# EAGLE board base-module-r1_MI_1 (EAGLE 5.12)
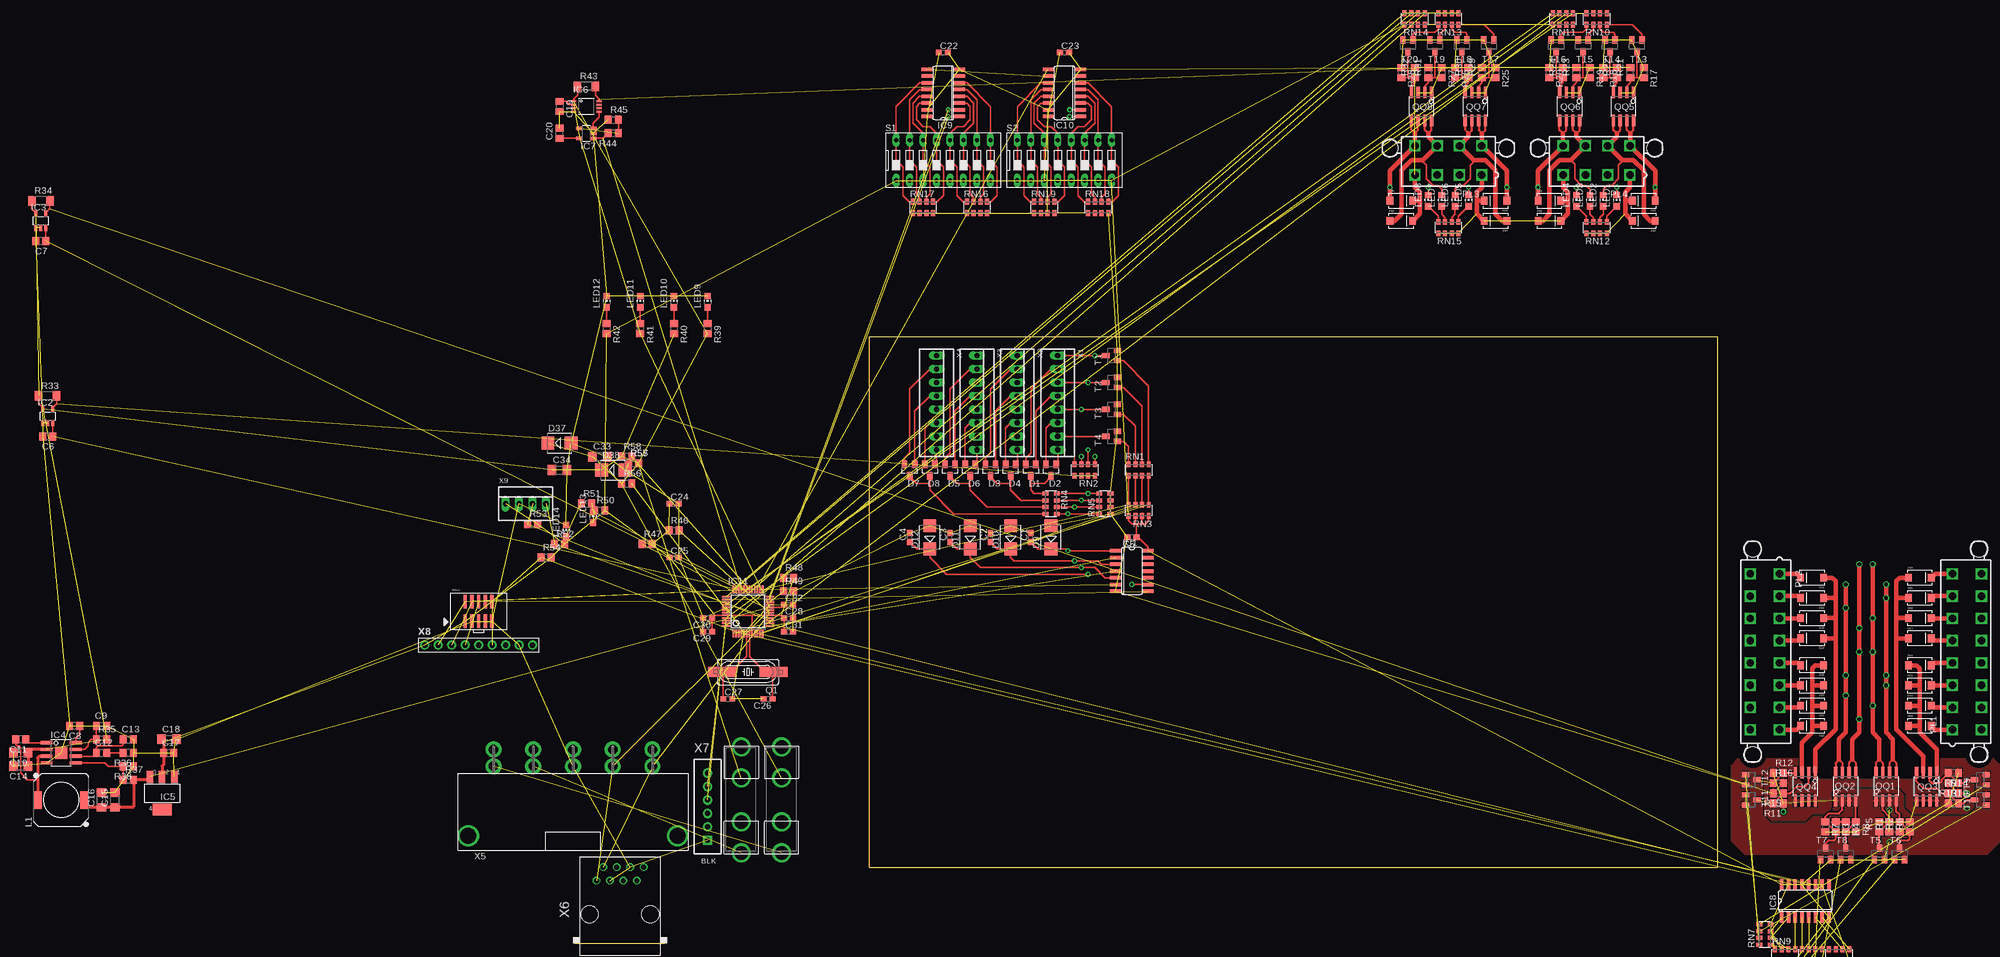
[diagram p3: board, top side]
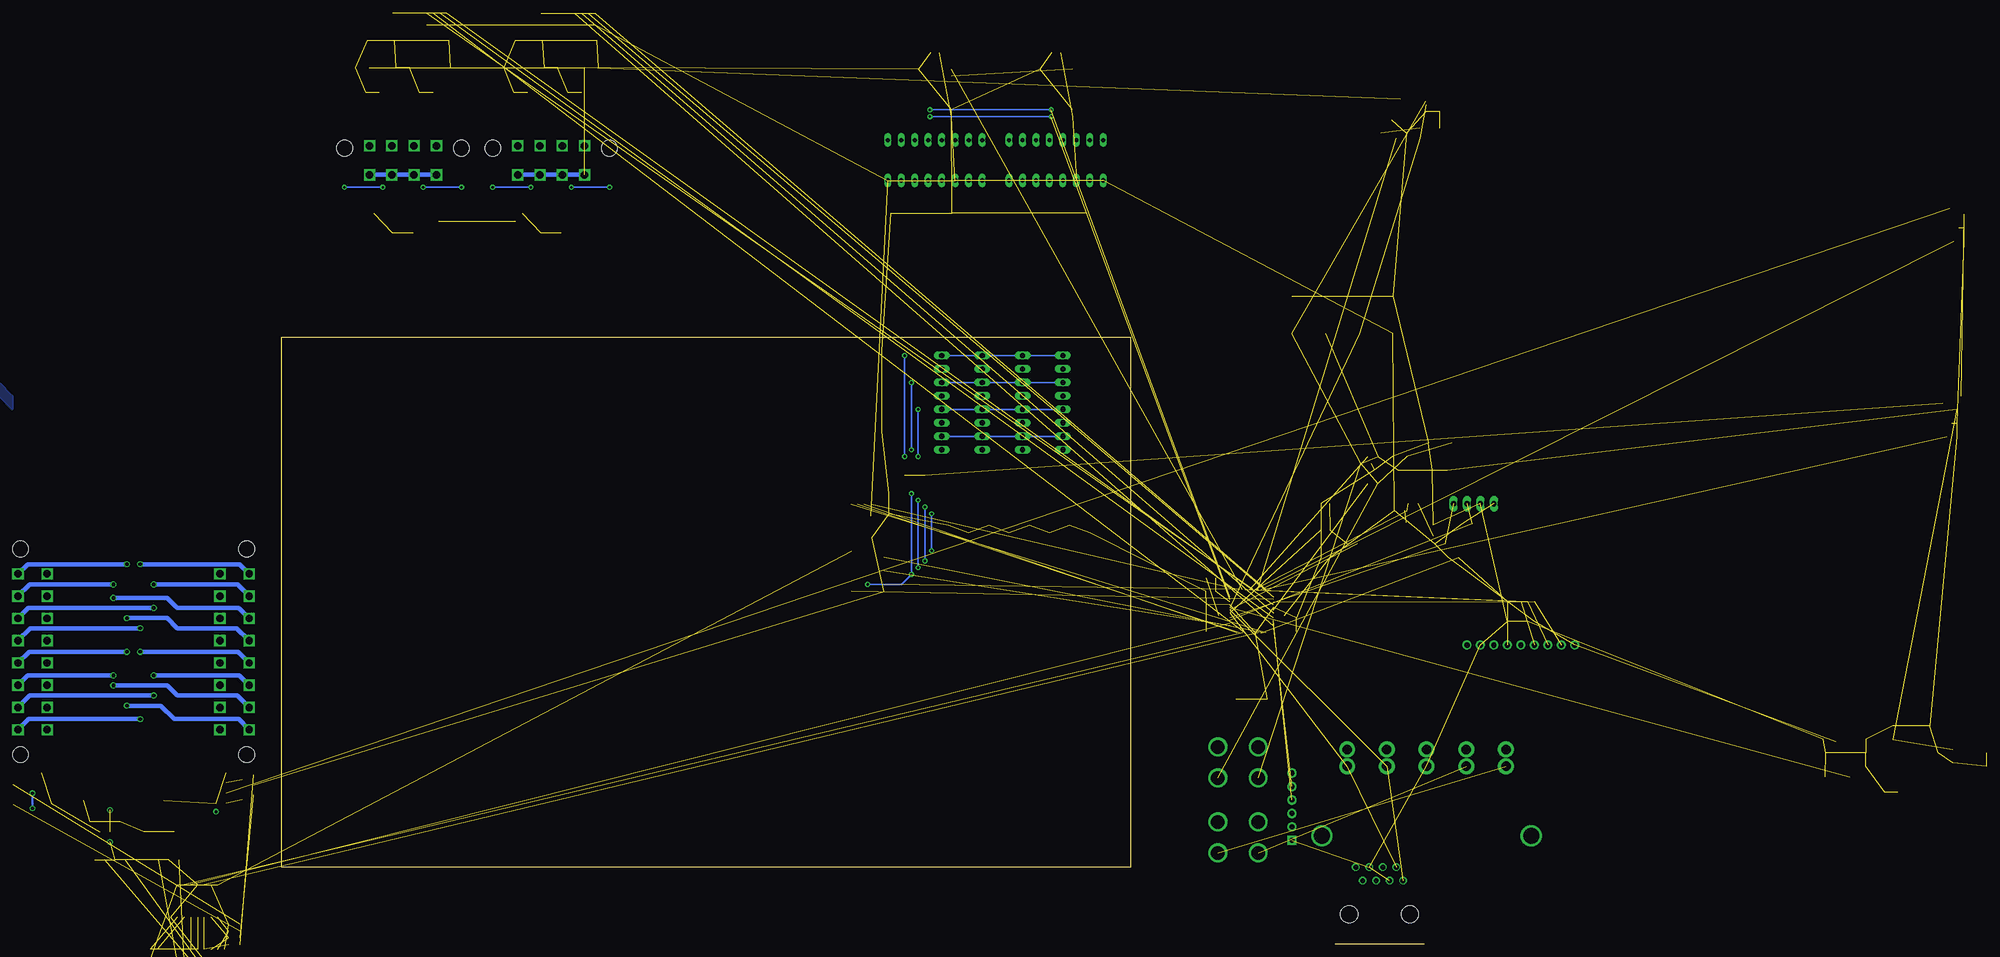
[diagram p4: board, bottom side, seen from below]

Size 215.44 x 114.4 mm. Coordinates in mm from the lower left corner, seen from the top.
Outline: 55.44,14.4 215.44,14.4 215.44,114.4 55.44,114.4 55.44,14.4
Copper layers (1*16): Top 0.035mm / dielectric 1.5mm / Bottom 0.035mm
Design rules "default *": minimum track width 10mil, minimum drill 0.6mm, track to track 8mil, track to pad 8mil, pad to pad 7mil, via to via 8mil, smd to smd 8mil, copper to edge 40mil, drill to drill 8mil, minimum pad ring 10mil, minimum via ring 8mil, stop-mask expansion 4mil, vias tented up to drill 0mil, thermal gap 10mil

## Footprints (pad centres in the part's own frame; a part is rotated, then mirrored left to right if it is on the bottom)
C0603 = smd 1.1 x 1: 1 -0.85,0; 2 0.85,0
C0805 = smd 1.3 x 1.5: 1 -0.95,0; 2 0.95,0
C1206 = smd 1.6 x 1.8: 1 -1.4,0; 2 1.4,0
SOT23 = smd 1 x 1.4: 1 -0.95,-1.1; 2 0.95,-1.1; 3 0,1.1
SMB = smd 2.4 x 2.4: A 2.2,0; C -2.2,0
SMA-DIODE = smd 1.27 x 1.47: A -2.15,0; C 2.15,0
FUSE_5MM = drill 2.54 pad 3.556 round: 1 0,-10; 2 0,-4.158; 3 0,4.158; 4 0,10
SO14 = smd 0.66 x 2.032: 1 -3.81,-3.073; 2 -2.54,-3.073; 3 -1.27,-3.073; 4 0,-3.073; 5 1.27,-3.073; 6 2.54,-3.073; 7 3.81,-3.073; 8 3.81,3.073; 9 2.54,3.073; 10 1.27,3.073; 11 0,3.073; 12 -1.27,3.073; 13 -2.54,3.073; 14 -3.81,3.073
SOT23-5L = smd 0.55 x 1.2: 1 -0.95,-1.3; 2 0,-1.3; 3 0.95,-1.3; 4 0.95,1.3; 5 -0.95,1.3
SO08 = smd 0.61 x 2.21: 1 -1.905,-2.75; 2 -0.635,-2.75; 3 0.635,-2.75; 4 1.905,-2.75; 5 1.905,2.75; 6 0.635,2.75; 7 -0.635,2.75; 8 -1.905,2.75 | smd 2.3 x 2.3: SLUG 0,0
SOT223 = smd 1.219 x 2.235: 1 -2.311,-3.099; 2 0,-3.099; 3 2.311,-3.099 | smd 3.6 x 2.2: 4 0,3.099
MSOP-8 = smd 0.41 x 1.02: 1 -0.975,-2.4; 2 -0.325,-2.4; 3 0.325,-2.4; 4 0.975,-2.4; 5 0.975,2.4; 6 0.325,2.4; 7 -0.325,2.4; 8 -0.975,2.4
SOT23-5 = smd 0.6 x 1.2: 1 -0.95,-1.306; 2 0,-1.306; 3 0.95,-1.306; 4 0.95,1.306; 5 -0.95,1.306
SO16 = smd 0.66 x 2.032: 1 -4.445,-3.073; 2 -3.175,-3.073; 3 -1.905,-3.073; 4 -0.635,-3.073; 5 0.635,-3.073; 6 1.905,-3.073; 7 3.175,-3.073; 8 4.445,-3.073; 9 4.445,3.073; 10 3.175,3.073; 11 1.905,3.073; 12 0.635,3.073; 13 -0.635,3.073; 14 -1.905,3.073; 15 -3.175,3.073; 16 -4.445,3.073
LQFP48 = smd 0.3 x 1.6: 1 -2.75,-4.1; 2 -2.25,-4.1; 3 -1.75,-4.1; 4 -1.25,-4.1; 5 -0.75,-4.1; 6 -0.25,-4.1; 7 0.25,-4.1; 8 0.75,-4.1; 9 1.25,-4.1; 10 1.75,-4.1; 11 2.25,-4.1; 12 2.75,-4.1; 25 2.75,4.1; 26 2.25,4.1; 27 1.75,4.1; 28 1.25,4.1; 29 0.75,4.1; 30 0.25,4.1; 31 -0.25,4.1; 32 -0.75,4.1; 33 -1.25,4.1; 34 -1.75,4.1; 35 -2.25,4.1; 36 -2.75,4.1 | smd 1.6 x 0.3: 13 4.1,-2.75; 14 4.1,-2.25; 15 4.1,-1.75; 16 4.1,-1.25; 17 4.1,-0.75; 18 4.1,-0.25; 19 4.1,0.25; 20 4.1,0.75; 21 4.1,1.25; 22 4.1,1.75; 23 4.1,2.25; 24 4.1,2.75; 37 -4.1,2.75; 38 -4.1,2.25; 39 -4.1,1.75; 40 -4.1,1.25; 41 -4.1,0.75; 42 -4.1,0.25; 43 -4.1,-0.25; 44 -4.1,-0.75; 45 -4.1,-1.25; 46 -4.1,-1.75; 47 -4.1,-2.25; 48 -4.1,-2.75
2X05_1.27MM_SMT = smd 0.65 x 2.6: 1 -2.54,-1.85; 2 -2.54,1.85; 3 -1.27,-1.85; 4 -1.27,1.85; 5 0,-1.85; 6 0,1.85; 7 1.27,-1.85; 8 1.27,1.85; 9 2.54,-1.85; 10 2.54,1.85
DR1030 = smd 3.3 x 1.6: 1 0,4.45; 2 0,-4.45
CHIP-LED0805 = smd 1.2 x 1.2: A 0,-1.05; C 0,1.05
5566-16 = drill 1.4 square: 1 14.7,-2.75; 2 10.5,-2.75; 3 6.3,-2.75; 4 2.1,-2.75; 5 -2.1,-2.75; 6 -6.3,-2.75; 7 -10.5,-2.75; 8 -14.7,-2.75; 9 14.7,2.75; 10 10.5,2.75; 11 6.3,2.75; 12 2.1,2.75; 13 -2.1,2.75; 14 -6.3,2.75; 15 -10.5,2.75; 16 -14.7,2.75 | hole 3: 19.4,2.29; -19.4,2.29
5566-8 = drill 1.4 square: 1 6.3,-2.75; 2 2.1,-2.75; 3 -2.1,-2.75; 4 -6.3,-2.75; 5 6.3,2.75; 6 2.1,2.75; 7 -2.1,2.75; 8 -6.3,2.75 | hole 3: 11,2.29; -11,2.29
HC49UP = smd 5.334 x 1.93: 1 -4.826,0; 2 4.826,0
SO-8 = smd 2.21 x 0.61: 1 -2.616,1.905; 2 -2.616,0.635; 3 -2.616,-0.635; 4 -2.616,-1.905; 5 2.616,-1.905; 6 2.616,-0.635; 7 2.616,0.635; 8 2.616,1.905
R0805 = smd 1.3 x 1.5: 1 -0.95,0; 2 0.95,0
M3516 = smd 1.4 x 1.8: 1 -1.7,0; 2 1.7,0
EXBS8V = smd 0.75 x 1.1: 1 -1.905,-1.07; 2 -0.635,-1.07; 3 0.635,-1.07; 4 1.905,-1.07; 5 1.905,1.07; 6 0.635,1.07; 7 -0.635,1.07; 8 -1.905,1.07
DS-08 = drill 0.813 long: 1 -8.89,-3.81; 2 -6.35,-3.81; 3 -3.81,-3.81; 4 -1.27,-3.81; 5 1.27,-3.81; 6 3.81,-3.81; 7 6.35,-3.81; 8 8.89,-3.81; 9 8.89,3.81; 10 6.35,3.81; 11 3.81,3.81; 12 1.27,3.81; 13 -1.27,3.81; 14 -3.81,3.81; 15 -6.35,3.81; 16 -8.89,3.81
SOT23-BEC = smd 1 x 1.4: B -0.95,-1.1; C 0,1.1; E 0.95,-1.1
22-23-2081 = drill 1 long: 1 -8.89,0; 2 -6.35,0; 3 -3.81,0; 4 -1.27,0; 5 1.27,0; 6 3.81,0; 7 6.35,0; 8 8.89,0
43160-XX05 = drill 1.8 pad 3 round: 1@1 -14.98,0; 1@2 -14.98,3.18; 2@1 -7.49,0; 2@2 -7.49,3.18; 3@1 0,0; 3@2 0,3.18; 4@1 7.49,0; 4@2 7.49,3.18; 5@1 14.98,0; 5@2 14.98,3.18 | drill 3 pad 3.4 round: M1 -19.73,-13.13; M2 19.73,-13.13
RJ45-NO-SHIELD = drill 0.9 pad 1.4 round: 1 -4.445,6.35; 2 -3.175,8.89; 3 -1.905,6.35; 4 -0.635,8.89; 5 0.635,6.35; 6 1.905,8.89; 7 3.175,6.35; 8 4.445,8.89 | hole 3.251: -5.715,0; 5.715,0
USBCABLE-0.100-NOLBL = drill 1 pad 1.778 square: 1 0,-7.62 | drill 1 pad 1.778 round: 2 0,-5.08; 3 0,-2.54; 4 0,0; 5 0,2.54; 6 0,5.08
100MIL-9 = drill 1 pad 1.676 round: 1 -10.16,0; 2 -7.62,0; 3 -5.08,0; 4 -2.54,0; 5 0,0; 6 2.54,0; 7 5.08,0; 8 7.62,0; 9 10.16,0
22-23-2041 = drill 1 long: 1 -3.81,0; 2 -1.27,0; 3 1.27,0; 4 3.81,0

## Placement (x,y rotation side)
C1  CYA  [C0603]  85.92,76.63 90 top
C2  CYA  [C0603]  78.3,76.63 90 top
C3  CYA  [C0603]  70.68,76.63 90 top
C4  CYA  [C0603]  63.06,76.63 90 top
C5  100n  [C0603]  104.97,76.63 180 top
C6  .047  [C0805]  -99.5,95.68 180 top  (outside the outline)
C7  .047  [C0805]  -100.77,132.51 180 top  (outside the outline)
C8  100n  [C0805]  -94.42,41.07 180 top  (outside the outline)
C9  100n  [C0805]  -89.34,41.07 0 top  (outside the outline)
C10  10u  [C1206]  -104.58,35.99 180 top  (outside the outline)
C11  100n  [C0805]  -104.58,38.53 180 top  (outside the outline)
C12  3.3n  [C0805]  -89.34,35.99 0 top  (outside the outline)
C13  DNP  [C0805]  -84.26,38.53 0 top  (outside the outline)
C14  10u  [C1206]  -104.58,33.45 180 top  (outside the outline)
C15  22u  [C1206]  -86.8,27.1 90 top  (outside the outline)
C16  22u  [C1206]  -89.34,27.1 90 top  (outside the outline)
C17  2.2u  [C0805]  -76.64,35.99 0 top  (outside the outline)
C18  10u  [C1206]  -76.64,38.53 0 top  (outside the outline)
C19  100n  [C0805]  -2.98,157.91 270 top  (outside the outline)
C20  100n  [C0805]  -2.98,152.83 90 top  (outside the outline)
C21  100n  [C0603]  226.89,-12.27 0 top  (outside the outline)
C22  100n  [C0603]  69.41,168.07 0 top  (outside the outline)
C23  100n  [C0603]  92.27,168.07 0 top  (outside the outline)
C24  1n  [C0603]  18.61,82.98 0 top
C25  10n  [C0603]  18.61,72.82 0 top
C26  18p  [C0603]  36.39,46.15 180 top
C27  18p  [C0603]  28.77,46.15 0 top
C28  10n  [C0603]  40.2,61.39 0 top
C29  10n  [C0603]  24.96,58.85 180 top
C30  100n  [C0603]  24.96,61.39 180 top
C31  100n  [C0603]  40.2,58.85 0 top
C32  100n  [C0603]  40.2,63.93 0 top
C33  10u  [C1206]  4.64,91.87 0 top
C34  10u  [C1206]  -2.98,89.33 0 top
D1  BAT54C  [SOT23]  85.92,89.33 180 top
D2  BAT54C  [SOT23]  89.73,89.33 180 top
D3  BAT54C  [SOT23]  78.3,89.33 180 top
D4  BAT54C  [SOT23]  82.11,89.33 180 top
D5  BAT54C  [SOT23]  70.68,89.33 180 top
D6  BAT54C  [SOT23]  74.49,89.33 180 top
D7  BAT54C  [SOT23]  63.06,89.33 180 top
D8  BAT54C  [SOT23]  66.87,89.33 180 top
D9  [SMB]  89.73,76.63 90 top
D10  [SMB]  82.11,76.63 90 top
D11  [SMB]  74.49,76.63 90 top
D12  [SMB]  66.87,76.63 90 top
D13  [SMA-DIODE]  253.56,41.07 0 top  (outside the outline)
D14  [SMA-DIODE]  253.56,44.88 0 top  (outside the outline)
D15  [SMA-DIODE]  253.56,48.69 0 top  (outside the outline)
D16  [SMA-DIODE]  253.56,52.5 0 top  (outside the outline)
D17  [SMA-DIODE]  253.56,57.58 0 top  (outside the outline)
D18  [SMA-DIODE]  253.56,61.39 0 top  (outside the outline)
D19  [SMA-DIODE]  253.56,65.2 0 top  (outside the outline)
D20  [SMA-DIODE]  253.56,69.01 0 top  (outside the outline)
D21  [SMA-DIODE]  233.24,69.01 180 top  (outside the outline)
D22  [SMA-DIODE]  233.24,65.2 180 top  (outside the outline)
D23  [SMA-DIODE]  233.24,61.39 180 top  (outside the outline)
D24  [SMA-DIODE]  233.24,57.58 180 top  (outside the outline)
D25  [SMA-DIODE]  233.24,52.5 180 top  (outside the outline)
D26  [SMA-DIODE]  233.24,48.69 180 top  (outside the outline)
D27  [SMA-DIODE]  233.24,44.88 180 top  (outside the outline)
D28  [SMA-DIODE]  233.24,41.07 180 top  (outside the outline)
D29  [SMA-DIODE]  201.49,140.13 180 top  (outside the outline)
D30  [SMA-DIODE]  201.49,136.32 180 top  (outside the outline)
D31  [SMA-DIODE]  183.71,136.32 0 top  (outside the outline)
D32  [SMA-DIODE]  183.71,140.13 0 top  (outside the outline)
D33  [SMA-DIODE]  173.55,140.13 180 top  (outside the outline)
D34  [SMA-DIODE]  173.55,136.32 180 top  (outside the outline)
D35  [SMA-DIODE]  155.77,136.32 0 top  (outside the outline)
D36  [SMA-DIODE]  155.77,140.13 0 top  (outside the outline)
D37  [SMB]  -2.98,94.41 0 top
D38  [SMB]  7.18,89.33 0 top
F1  FUSEX20MM  [FUSE_5MM]  38.93,27.1 0 top
F2  FUSEX20MM  [FUSE_5MM]  31.31,27.1 0 top
IC1  74HC14D  [SO14]  104.97,70.28 270 top
IC2  TS1102  [SOT23-5L]  -99.5,99.49 0 top  (outside the outline)
IC3  TS1102  [SOT23-5L]  -100.77,136.32 0 top  (outside the outline)
IC4  RT7247A  [SO08]  -96.96,35.99 270 top  (outside the outline)
IC5  LM1117-3.3V  [SOT223]  -77.91,28.37 180 top  (outside the outline)
IC6  LMP8480MM  [MSOP-8]  2.1,157.91 270 top  (outside the outline)
IC7  MCP6001  [SOT23-5]  2.1,152.83 90 top  (outside the outline)
IC8  74HC595D  [SO16]  231.97,8.05 0 top  (outside the outline)
IC9  74HC165D  [SO16]  69.41,160.45 90 top  (outside the outline)
IC10  74HC165D  [SO16]  92.27,160.45 90 top  (outside the outline)
IC11  LPC11C22/24-LQFP48  [LQFP48]  32.58,62.66 0 top
JTAG1  [2X05_1.27MM_SMT]  -18.22,62.66 0 top  (outside the outline)
L1  [DR1030]  -96.96,27.1 90 top  (outside the outline)
LED1  [CHIP-LED0805]  196.41,140.13 0 top  (outside the outline)
LED2  [CHIP-LED0805]  193.87,140.13 0 top  (outside the outline)
LED3  [CHIP-LED0805]  191.33,140.13 0 top  (outside the outline)
LED4  [CHIP-LED0805]  188.79,140.13 0 top  (outside the outline)
LED5  [CHIP-LED0805]  168.47,140.13 0 top  (outside the outline)
LED6  [CHIP-LED0805]  165.93,140.13 0 top  (outside the outline)
LED7  [CHIP-LED0805]  163.39,140.13 0 top  (outside the outline)
LED8  [CHIP-LED0805]  160.85,140.13 0 top  (outside the outline)
LED9  PWR  [CHIP-LED0805]  24.96,121.08 0 top  (outside the outline)
LED10  12V  [CHIP-LED0805]  18.61,121.08 0 top  (outside the outline)
LED11  5V  [CHIP-LED0805]  12.26,121.08 0 top  (outside the outline)
LED12  3.3V  [CHIP-LED0805]  5.91,121.08 0 top  (outside the outline)
LED13  HBB  [CHIP-LED0805]  3.37,80.44 0 top
LED14  HBA  [CHIP-LED0805]  -1.71,77.9 0 top
PL1  [5566-16]  262.45,55.04 270 top  (outside the outline)
PL2  [5566-16]  224.35,55.04 90 top  (outside the outline)
PL3  [5566-8]  164.66,147.75 0 top  (outside the outline)
PL4  [5566-8]  192.6,147.75 0 top  (outside the outline)
Q1  12MHz  [HC49UP]  32.58,51.23 180 top
QQ1  IRF9910  [SO-8]  247.21,29.64 90 top  (outside the outline)
QQ2  IRF9910  [SO-8]  239.59,29.64 90 top  (outside the outline)
QQ3  IRF9362  [SO-8]  254.83,29.64 270 top  (outside the outline)
QQ4  IRF9362  [SO-8]  231.97,29.64 270 top  (outside the outline)
QQ5  DMN6040SSD  [SO-8]  197.68,157.91 270 top  (outside the outline)
QQ6  DMN6040SSD  [SO-8]  187.52,157.91 270 top  (outside the outline)
QQ7  DMN6040SSD  [SO-8]  169.74,157.91 270 top  (outside the outline)
QQ8  DMN6040SSD  [SO-8]  159.58,157.91 270 top  (outside the outline)
R1  [R0805]  247.84,22.02 90 top  (outside the outline)
R2  [R0805]  249.75,22.02 90 top  (outside the outline)
R3  [R0805]  237.68,22.02 270 top  (outside the outline)
R4  [R0805]  239.59,22.02 270 top  (outside the outline)
R5  [R0805]  245.94,22.02 90 top  (outside the outline)
R6  [R0805]  251.65,22.02 90 top  (outside the outline)
R7  [R0805]  235.78,22.02 270 top  (outside the outline)
R8  [R0805]  241.49,22.02 270 top  (outside the outline)
R9  [R0805]  259.91,32.18 180 top  (outside the outline)
R10  [R0805]  259.91,26.47 0 top  (outside the outline)
R11  [R0805]  226.89,26.47 180 top  (outside the outline)
R12  [R0805]  226.89,32.18 0 top  (outside the outline)
R13  [R0805]  259.91,30.28 180 top  (outside the outline)
R14  [R0805]  259.91,28.37 0 top  (outside the outline)
R15  [R0805]  226.89,28.37 180 top  (outside the outline)
R16  [R0805]  226.89,30.28 0 top  (outside the outline)
R17  [R0805]  201.49,164.26 270 top  (outside the outline)
R18  [R0805]  193.87,164.26 270 top  (outside the outline)
R19  [R0805]  191.33,164.26 270 top  (outside the outline)
R20  [R0805]  183.71,164.26 270 top  (outside the outline)
R21  [R0805]  198.95,164.26 90 top  (outside the outline)
R22  [R0805]  196.41,164.26 90 top  (outside the outline)
R23  [R0805]  188.79,164.26 90 top  (outside the outline)
R24  [R0805]  186.25,164.26 90 top  (outside the outline)
R25  [R0805]  173.55,164.26 270 top  (outside the outline)
R26  [R0805]  165.93,164.26 270 top  (outside the outline)
R27  [R0805]  163.39,164.26 270 top  (outside the outline)
R28  [R0805]  155.77,164.26 270 top  (outside the outline)
R29  [R0805]  171.01,164.26 90 top  (outside the outline)
R30  [R0805]  168.47,164.26 90 top  (outside the outline)
R31  [R0805]  160.85,164.26 90 top  (outside the outline)
R32  [R0805]  158.31,164.26 90 top  (outside the outline)
R33  [M3516]  -99.5,103.3 0 top  (outside the outline)
R34  [M3516]  -100.77,140.13 0 top  (outside the outline)
R35  100K  [R0805]  -89.34,38.53 0 top  (outside the outline)
R36  20K  [R0805]  -84.26,35.99 180 top  (outside the outline)
R37  62K  [R0805]  -84.26,30.91 0 top  (outside the outline)
R38  11.8K  [R0805]  -84.26,33.45 180 top  (outside the outline)
R39  [R0805]  24.96,116 270 top
R40  [R0805]  18.61,116 270 top
R41  [R0805]  12.26,116 270 top
R42  [R0805]  5.91,116 270 top
R43  [M3516]  2.1,161.72 0 top  (outside the outline)
R44  680  [R0805]  7.18,152.83 180 top  (outside the outline)
R45  1K  [R0805]  7.18,155.37 0 top  (outside the outline)
R46  60  [R0805]  18.61,77.9 0 top
R47  60  [R0805]  13.53,75.36 0 top
R48  DNP  [R0805]  40.2,69.01 0 top
R49  0  [R0805]  40.2,66.47 0 top
R50  [R0805]  4.64,81.71 0 top
R51  [R0805]  2.1,82.98 0 top
R52  [R0805]  -2.98,75.36 0 top
R53  [R0805]  -8.06,79.17 0 top  (outside the outline)
R54  12K  [R0805]  -5.52,72.82 0 top  (outside the outline)
R55  [R0805]  10.99,90.6 0 top
R56  [R0805]  9.72,86.79 0 top
R57  [R0805]  10.99,90.6 0 top
R58  [R0805]  9.72,91.87 0 top
RN1  1K  [EXBS8V]  106.24,89.33 0 top
RN2  1K  [EXBS8V]  96.08,89.33 180 top
RN3  1K  [EXBS8V]  106.24,81.71 180 top
RN4  1K  [EXBS8V]  89.73,82.98 270 top
RN5  1K  [EXBS8V]  99.89,82.98 90 top
RN6  1K  [EXBS8V]  233.24,-2.11 180 top  (outside the outline)
RN7  1K  [EXBS8V]  224.35,1.7 90 top  (outside the outline)
RN8  1K  [EXBS8V]  238.32,-2.11 180 top  (outside the outline)
RN9  1K  [EXBS8V]  228.16,-2.11 0 top  (outside the outline)
RN10  1K  [EXBS8V]  192.6,174.42 180 top  (outside the outline)
RN11  1K  [EXBS8V]  186.25,174.42 180 top  (outside the outline)
RN12  1K  [EXBS8V]  192.6,135.05 180 top  (outside the outline)
RN13  1K  [EXBS8V]  164.66,174.42 180 top  (outside the outline)
RN14  1K  [EXBS8V]  158.31,174.42 180 top  (outside the outline)
RN15  1K  [EXBS8V]  164.66,135.05 180 top  (outside the outline)
RN16  1K  [EXBS8V]  75.76,138.86 0 top  (outside the outline)
RN17  1K  [EXBS8V]  65.6,138.86 0 top  (outside the outline)
RN18  1K  [EXBS8V]  98.62,138.86 0 top  (outside the outline)
RN19  1K  [EXBS8V]  88.46,138.86 0 top  (outside the outline)
S1  [DS-08]  69.41,147.75 0 top  (outside the outline)
S2  [DS-08]  92.27,147.75 0 top  (outside the outline)
T1  [SOT23-BEC]  101.16,110.92 90 top
T2  [SOT23-BEC]  101.16,105.84 90 top
T3  [SOT23-BEC]  101.16,100.76 90 top
T4  [SOT23-BEC]  101.16,95.68 90 top
T5  [SOT23-BEC]  245.94,16.94 0 top  (outside the outline)
T6  [SOT23-BEC]  249.75,16.94 0 top  (outside the outline)
T7  [SOT23-BEC]  235.78,16.94 0 top  (outside the outline)
T8  [SOT23-BEC]  239.59,16.94 0 top  (outside the outline)
T9  [SOT23-BEC]  264.99,30.91 90 top  (outside the outline)
T10  [SOT23-BEC]  264.99,27.1 90 top  (outside the outline)
T11  [SOT23-BEC]  221.81,27.1 270 top  (outside the outline)
T12  [SOT23-BEC]  221.81,30.91 270 top  (outside the outline)
T13  [SOT23-BEC]  200.22,169.34 180 top  (outside the outline)
T14  [SOT23-BEC]  195.14,169.34 180 top  (outside the outline)
T15  [SOT23-BEC]  190.06,169.34 180 top  (outside the outline)
T16  [SOT23-BEC]  184.98,169.34 180 top  (outside the outline)
T17  [SOT23-BEC]  172.28,169.34 180 top  (outside the outline)
T18  [SOT23-BEC]  167.2,169.34 180 top  (outside the outline)
T19  [SOT23-BEC]  162.12,169.34 180 top  (outside the outline)
T20  [SOT23-BEC]  157.04,169.34 180 top  (outside the outline)
X1  22-23-2081  [22-23-2081]  91,102.03 270 top
X2  22-23-2081  [22-23-2081]  83.38,102.03 270 top
X3  22-23-2081  [22-23-2081]  75.76,102.03 270 top
X4  22-23-2081  [22-23-2081]  68.14,102.03 270 top
X5  43160-3105  [43160-XX05]  -0.44,33.45 0 top
X6  RJ45-8X  [RJ45-NO-SHIELD]  8.45,5.51 0 top
X7  TTL-232R-5VN  [USBCABLE-0.100-NOLBL]  24.96,27.1 0 top
X8  M09-100MIL  [100MIL-9]  -18.22,56.31 0 top  (outside the outline)
X9  22-23-2041  [22-23-2041]  -9.33,82.98 0 top  (outside the outline)

## Tracks (layer width: path | path; a pad name or v marks a point on that pad's centre or on a via)
12V_SENSE  (1 unrouted)
50V_SENSE  (1 unrouted)
+3V3  (47 unrouted)
  Top 0.254: IC1.14 108.04,74.83 106.24,76.63 C5.1 105.82,78.96 105.6,79.17 | RN3.5 104.33,79.81 104.97,79.17 105.6,79.17 | 105.6,79.17 106.87,79.17 | 106.87,79.17 107.51,79.17 108.14,79.81 RN3.8 | 106.87,79.17 RN3.7 | 105.6,79.17 RN3.6 | 33.21,61.91 IC11.44 26.33,61.91 C30.1 C29.1 | 33.21,61.91 IC11.17 38.83,61.91 C28.1 C31.1 | IC11.8 33.33,61.8 33.21,61.91
  Top 0.61: IC5.2 -77.91,33.45 -77.59,33.77 C17.1 -77.59,38.08 C18.1
+5V  (4 unrouted)
  Top 0.254: IC6.2 -1.09,158.24 -1.71,158.86 C19.1 | C20.1 IC7.5 | IC11.20 38.83,63.41 C32.1
  Top 0.61: L1.2 -92.52,26.15 -92.07,25.7 C16.1 C15.1 -83.44,25.7 -83.31,25.83 R37.2 | R37.2 | R37.2 -80.79,30.91 IC5.3
+12V  (9 unrouted)
  Top 0.254: IC2.5 -100.45,101.08 -101.2,101.83 R33.1 | IC3.5 -101.72,137.91 -102.47,138.66 R34.1
  Top 0.61: C14.1 C10.1 -102.55,36.63 IC4.2
CANH  (3 unrouted)
CANL  (3 unrouted)
DIP_CLK  (via drill 0.5)  (1 unrouted)
  Top 0.254: v93.22,157.28 IC10.2 | v70.36,157.28 IC9.2
  Bottom 0.254: v70.36,157.28 v93.22,157.28
DIP_DAT  (1 unrouted)
DIP_LAT  (via drill 0.5)  (1 unrouted)
  Top 0.254: v70.36,156.01 IC9.1 | v93.22,156.01 IC10.1
  Bottom 0.254: v70.36,156.01 v93.22,156.01
FTDI_RXD  (1 unrouted)
FTDI_TXD  (1 unrouted)
GND  (via drill 0.6)  (137 unrouted)
  Top 0.406: R3.1 R4.1 | R11.1 v227.84,24.88
  other vias: 247.84,25.2 247.84,19.16
  pour Bottom: 280.23,110.92 298.01,110.92 298.01,99.49 277.69,99.49 277.69,100.76 280.23,103.3
  pour Top (rank 2): 229.43,34.72 219.27,34.72 218,33.45 218,19.48 220.54,16.94 266.26,16.94 272.61,23.29 272.61,29.64 267.53,34.72
HEARTBEAT  (2 unrouted)
LAMP_12V  (via drill 0.6)  (5 unrouted)
  Top 0.254: IC3.4 -99.82,137.91 -99.07,138.66 R34.2 | R13.2 R14.2 | R15.2 R16.2
  Bottom 0.406: v262.45,25.51 v262.45,28.37
  pour Bottom: 268.8,105.84 266.26,103.3 266.26,100.76 268.8,103.3
  pour Top: 224.35,32.18 224.35,24.56 225.62,23.29 231.97,23.29 233.24,24.56 235.78,24.56 236.73,25.51 236.73,28.69 237.68,29.64 249.75,29.64 251.02,28.37 251.02,25.83 252.29,24.56 262.45,24.56 263.72,25.83 263.72,30.91 262.45,32.18 258.64,32.18 256.1,29.64 254.83,30.91 234.51,30.91 231.97,29.64 229.43,32.18
LAMP_CLK  (1 unrouted)
LAMP_COL0  (2 unrouted)
LAMP_COL0_PWR  (via drill 0.7)
  Top 0.406: QQ1.7 246.57,34.09 245.94,34.72 245.3,34.09 QQ1.8
  Top 0.813: 245.94,34.72 245.94,38.53 244.67,39.8 v244.67,44.88 v244.67,55.04 v244.67,61.39 v244.67,71.55
  Bottom 0.813: PL1.16 263.39,71.55 v244.67,71.55 | PL1.12 263.1,55.04 v244.67,55.04 | PL2.16 223.6,42.34 235.78,42.34 238.32,44.88 v244.67,44.88 | PL2.12 223.94,59.49 235.14,59.49 237.05,61.39 v244.67,61.39
LAMP_COL1  (2 unrouted)
LAMP_COL1_PWR  (via drill 0.7)
  Top 0.406: QQ1.6 247.84,34.09 248.48,34.72 249.11,34.09 QQ1.5
  Top 0.813: v247.21,67.74 v247.21,65.2 v247.21,50.6 v247.21,48.69 247.21,39.8 248.48,38.53 248.48,34.72
  Bottom 0.813: PL1.11 263.34,50.6 v247.21,50.6 | PL1.15 263,67.74 v247.21,67.74 | PL2.11 223.55,63.3 235.14,63.3 237.05,65.2 v247.21,65.2 | PL2.15 223.84,46.79 235.14,46.79 237.05,48.69 v247.21,48.69
LAMP_COL2  (2 unrouted)
LAMP_COL2_PWR  (via drill 0.7)
  Top 0.406: QQ2.8 237.68,34.09 238.32,34.72 238.95,34.09 QQ2.7
  Top 0.813: 238.32,34.72 238.32,38.53 239.59,39.8 v239.59,46.79 v239.59,50.6 v239.59,63.3 v239.59,67.74
  Bottom 0.813: v239.59,67.74 223.8,67.74 PL2.10 | PL1.10 262.95,46.79 v239.59,46.79 | PL1.14 263.24,63.3 v239.59,63.3 | PL2.14 223.45,50.6 v239.59,50.6
LAMP_COL3  (2 unrouted)
LAMP_COL3_PWR  (via drill 0.7)
  Top 0.406: QQ2.6 240.22,34.09 240.86,34.72 241.49,34.09 QQ2.5
  Top 0.813: 240.86,34.72 240.86,38.53 242.13,39.8 v242.13,42.34 v242.13,55.04 v242.13,59.49 v242.13,71.55
  Bottom 0.813: PL2.9 223.41,71.55 v242.13,71.55 | PL1.9 263.2,42.34 v242.13,42.34 | PL1.13 262.85,59.49 v242.13,59.49 | PL2.13 223.7,55.04 v242.13,55.04
LAMP_DAT  (1 unrouted)
LAMP_LAT  (1 unrouted)
LAMP_ROW0  (2 unrouted)
LAMP_ROW0_PWR
  Top 0.813: D16.A 252.92,52.5 253.56,51.87 253.56,48.69 | 253.56,41.07 253.56,39.8 256.73,36.63 QQ3.1 | 253.56,41.07 253.56,44.88 | 253.56,44.88 253.56,48.69 | 253.56,44.88 D14.A | 253.56,48.69 D15.A | 253.56,41.07 D13.A
LAMP_ROW1  (2 unrouted)
LAMP_ROW1_PWR
  Top 0.813: D20.A 249.75,69.01 249.11,68.38 249.11,65.2 | 249.11,57.58 249.11,40.44 254.19,35.36 QQ3.3 | 249.11,57.58 249.11,61.39 | 249.11,61.39 249.11,65.2 | 249.11,65.2 D19.A | 249.11,61.39 D18.A | 249.11,57.58 D17.A
LAMP_ROW2  (2 unrouted)
LAMP_ROW2_PWR
  Top 0.813: D21.A 237.05,69.01 237.68,68.38 237.68,65.2 | 237.68,57.58 237.68,40.44 233.87,36.63 QQ4.1 | 237.68,57.58 237.68,61.39 | 237.68,61.39 237.68,65.2 | 237.68,65.2 D22.A | 237.68,61.39 D23.A | 237.68,57.58 D24.A
LAMP_ROW3  (2 unrouted)
LAMP_ROW3_PWR
  Top 0.813: D25.A 233.87,52.5 233.24,51.87 233.24,48.69 | 233.24,41.07 233.24,39.8 231.33,37.9 QQ4.3 | 233.24,41.07 233.24,44.88 | 233.24,44.88 233.24,48.69 | 233.24,41.07 D28.A | 233.24,44.88 D27.A | 233.24,48.69 D26.A
LAMP_SENSE  (1 unrouted)
  Top 0.254: IC3.3 C7.1
N$1
  Top 0.254: D2.2 88.78,97.27 89.73,98.22 X1.6
N$2
  Top 0.254: T4.B 103.38,94.73 104.33,93.78 RN1.8
N$3
  Top 0.254: T3.B 103.38,99.81 105.6,97.59 RN1.7
N$4
  Top 0.254: T2.B 103.38,104.89 106.87,101.4 RN1.6
N$5
  Top 0.254: T1.B 103.38,109.97 108.14,105.21 RN1.5
N$6
  Top 0.254: D1.1 86.87,100.44 89.73,103.3 X1.4
N$7
  Top 0.254: D1.2 84.97,91.56 85.92,92.51 85.92,104.57 89.73,108.38 X1.2
N$8
  Top 0.254: X1.8 91,90.75 D2.1
N$9  (via drill 0.5)
  Top 0.254: RN4.5 v92.9,81.08 RN5.8 | C1.1 87.27,74.43 D9.C 92.56,74.43 v92.9,74.09 IC1.1
  Bottom 0.254: v92.9,74.09 v92.9,81.08
N$10
  Top 0.254: D4.2 81.16,97.27 82.11,98.22 X2.6
N$11
  Top 0.254: D3.1 79.25,100.44 82.11,103.3 X2.4
N$12
  Top 0.254: D3.2 77.35,91.56 78.3,92.51 78.3,104.57 82.11,108.38 X2.2
N$13
  Top 0.254: X2.8 83.38,90.75 D4.1
N$14  (1 unrouted)
N$15
  Top 0.254: D6.2 73.54,97.27 74.49,98.22 X3.6
N$16
  Top 0.254: D5.1 71.63,100.44 74.49,103.3 X3.4
N$17
  Top 0.254: D5.2 69.73,91.56 70.68,92.51 70.68,104.57 74.49,108.38 X3.2
N$18
  Top 0.254: X3.8 75.76,90.75 D6.1
N$19  (via drill 0.5)
  Top 0.254: RN4.6 v94.17,82.35 RN5.7 | C2.1 79.65,74.43 D10.C 82.11,72.82 82.74,72.19 v94.17,72.19 98.62,72.19 99.25,71.55 IC1.3
  Bottom 0.254: v94.17,72.19 v94.17,82.35
N$20
  Top 0.254: D8.2 65.92,97.27 66.87,98.22 X4.6
N$21
  Top 0.254: D7.1 64.01,100.44 66.87,103.3 X4.4
N$22
  Top 0.254: D7.2 62.11,91.56 63.06,92.51 63.06,104.57 66.87,108.38 X4.2
N$23
  Top 0.254: X4.8 68.14,90.75 D8.1
N$24  (via drill 0.5)
  Top 0.254: RN4.7 v95.44,83.62 RN5.6 | C3.1 72.03,74.43 D11.C 74.49,72.82 76.39,70.92 v95.44,70.92 97.98,70.92 99.89,69.01 IC1.5
  Bottom 0.254: v95.44,70.92 v95.44,83.62
N$25  (via drill 0.5)
  Top 0.254: RN4.8 v96.71,84.89 RN5.5 | C4.1 64.41,74.43 D12.C 66.87,72.82 70.04,69.65 v96.71,69.65 | v104.97,67.74 IC1.9
  Bottom 0.254: v96.71,84.89 v96.71,69.65 98.62,67.74 v104.97,67.74
N$26  (1 unrouted)
N$27  (1 unrouted)
N$28
  Top 0.254: R5.1 R1.2
  Top 0.406: QQ1.2 246.57,25.2 247.84,23.93 R1.2 | T5.C R5.1
N$29
  Top 0.254: R2.2 R6.1
  Top 0.406: QQ1.4 249.11,24.88 249.75,24.24 R2.2 | T6.C 249.75,19.16 250.06,19.48 251.33,19.48 251.65,19.8 R6.1
N$30
  Top 0.254: R7.1 R3.2
  Top 0.406: QQ2.2 238.95,25.2 238.32,24.56 236.41,24.56 235.78,23.93 R7.1 | T7.C 235.78,18.85 236.41,19.48 237.36,19.48 237.68,19.8 R3.2
N$31
  Top 0.254: R8.1 R4.2
  Top 0.406: R8.1 QQ2.4 | T8.C R4.2
N$32  (1 unrouted)
N$33
  Top 0.254: R9.2 R13.1
  Top 0.406: R13.1 261.81,30.28 262.45,30.91 T9.C | QQ3.2 255.46,30.59 255.78,30.28 257.37,30.28 257.68,30.59 257.68,30.91 R9.2
N$34
  Top 0.254: R14.1 R10.2
  Top 0.406: QQ3.4 252.92,30.59 254.19,29.32 256.73,29.32 257.68,28.37 R14.1 | T10.C 262.45,27.1 261.81,26.47 R10.2
N$35  (1 unrouted)
  Top 0.254: R15.1 R11.2
  Top 0.406: QQ4.2 232.6,30.28 231.97,29.64 230.38,29.64 229.11,28.37 R15.1
N$36  (1 unrouted)
  Top 0.254: R12.2 R16.1
  Top 0.406: R12.2 230.06,32.18 QQ4.4
N$37  (1 unrouted)
N$38  (1 unrouted)
N$39  (1 unrouted)
N$40  (1 unrouted)
N$41
  Top 0.813: PL1.1 256.44,40.34 D13.C
N$42
  Top 0.813: PL1.2 256.05,44.54 D14.C
N$43
  Top 0.813: PL1.3 255.76,48.74 D15.C
N$44
  Top 0.813: PL1.4 256.15,52.94 D16.C
N$45
  Top 0.813: PL1.5 256.15,57.14 D17.C
N$46
  Top 0.813: PL1.6 255.76,61.34 D18.C
N$47
  Top 0.813: PL1.7 256.05,65.54 D19.C
N$48
  Top 0.813: PL1.8 256.44,69.74 D20.C
N$49
  Top 0.254: 200.22,163.31 R21.1 198.95,162.36 198.31,161.72 QQ5.2 | 200.22,163.31 R17.2 | 200.22,163.31 T13.C
N$50
  Top 0.254: 195.14,163.31 R22.1 196.41,162.36 195.77,161.72 QQ5.4 | 195.14,163.31 R18.2 | 195.14,163.31 T14.C
N$51
  Top 0.813: PL2.1 230.36,69.74 D21.C
N$52
  Top 0.813: PL2.2 230.75,65.54 D22.C
N$53
  Top 0.813: PL2.3 231.04,61.34 D23.C
N$54
  Top 0.813: PL2.4 230.65,57.14 D24.C
N$55
  Top 0.813: PL2.5 230.65,52.94 D25.C
N$56
  Top 0.813: PL2.6 231.04,48.74 D26.C
N$57
  Top 0.813: PL2.7 230.75,44.54 D27.C
N$58
  Top 0.813: PL2.8 230.36,40.34 D28.C
N$59
  Top 0.254: 190.06,163.31 R23.1 188.79,162.36 188.15,161.72 QQ6.2 | 190.06,163.31 R19.2 | 190.06,163.31 T15.C
N$60
  Top 0.254: 184.98,163.31 R20.2 | 184.98,163.31 R24.1 186.25,162.36 185.61,161.72 QQ6.4 | 184.98,163.31 T16.C
N$61
  Top 0.254: RN10.8 199.38,173.35 201.17,171.56 T13.B
N$62
  Top 0.254: T14.B 196.09,171.57 195.77,171.88 193.87,171.88 193.23,172.52 RN10.7
N$63
  Top 0.254: T15.B 191.01,171.56 191.96,172.52 RN10.6
N$64
  Top 0.254: T16.B 185.93,171.56 186.25,171.88 190.06,171.88 190.69,172.52 RN10.5
N$65  (via drill 0.5)
  Top 0.254: LED1.C v196.41,142.67
  Top 0.406: QQ5.8 199.58,153.47 198.95,152.83 198.31,153.47 QQ5.7
  Top 0.813: 198.95,152.83 198.95,150.55 PL4.5 203.64,145.76 v203.64,142.67 D29.A
  Bottom 0.254: v196.41,142.67 v203.64,142.67
N$66
  Top 0.254: LED2.C 193.87,142.35 194.5,142.99 195.45,142.99 196.72,144.26 196.72,146.8 197.68,147.75
  Top 0.406: QQ5.6 197.04,153.47 196.41,152.83 195.77,153.47 QQ5.5
  Top 0.813: 196.41,152.83 196.41,152.21 PL4.6 197.45,147.75 197.68,147.75 199.58,147.75 201.49,145.85 201.49,137.59 202.76,136.32 D30.A
N$67
  Top 0.254: LED3.C 191.33,142.35 190.69,142.99 189.74,142.99 188.47,144.26 188.47,147.03 187.75,147.75
  Top 0.406: QQ6.7 188.15,153.47 188.79,152.83 189.42,153.47 QQ6.8
  Top 0.813: 188.79,152.83 188.79,152.21 PL4.7 187.75,147.75 185.61,147.75 183.71,145.85 183.71,137.59 182.44,136.32 D31.A
N$68  (via drill 0.5)
  Top 0.254: v188.79,142.67 LED4.C
  Top 0.406: QQ6.5 185.61,153.47 186.25,152.83 186.88,153.47 QQ6.6
  Top 0.813: 186.25,152.83 186.25,150.55 PL4.8 181.56,145.76 v181.56,142.67 D32.A
  Bottom 0.254: v181.56,142.67 v188.79,142.67
N$69  (1 unrouted)
N$70
  Top 0.254: RN12.4 190.69,137.18 LED4.A
N$71
  Top 0.254: RN12.3 191.96,136.96 191.33,137.59 LED3.A
N$72
  Top 0.254: RN12.2 193.23,136.96 193.87,137.59 LED2.A
N$73
  Top 0.254: RN12.1 194.5,137.18 LED1.A
N$74
  Top 0.254: 172.28,163.31 R29.1 171.01,162.36 170.37,161.72 QQ7.2 | 172.28,163.31 R25.2 | 172.28,163.31 T17.C
N$75
  Top 0.254: 167.2,163.31 R26.2 | 167.2,163.31 R30.1 168.47,162.36 167.83,161.72 QQ7.4 | 167.2,163.31 T18.C
N$76
  Top 0.254: R27.2 162.12,163.31 | 162.12,163.31 T19.C | 162.12,163.31 R31.1 160.85,162.36 160.21,161.72 QQ8.2
N$77
  Top 0.254: QQ8.4 157.67,161.72 158.31,162.36 R32.1 157.04,163.31 | 157.04,163.31 R28.2 | T20.C 157.04,163.31
N$78
  Top 0.254: RN13.8 171.44,173.35 173.23,171.56 T17.B
N$79
  Top 0.254: RN13.7 165.29,172.52 165.93,171.88 167.83,171.88 168.15,171.56 T18.B
N$80
  Top 0.254: RN13.6 164.02,172.52 163.07,171.56 T19.B
N$81
  Top 0.254: RN13.5 162.75,172.52 162.12,171.88 158.31,171.88 157.99,171.56 T20.B
N$82  (via drill 0.5)
  Top 0.254: v168.47,142.67 LED5.C
  Top 0.406: QQ7.7 170.37,153.47 171.01,152.83 171.64,153.47 QQ7.8
  Top 0.813: 171.01,152.83 171.01,150.55 PL3.5 175.7,145.76 v175.7,142.67 D33.A
  Bottom 0.254: v175.7,142.67 v168.47,142.67
N$83
  Top 0.254: LED6.C 165.93,142.35 166.56,142.99 167.51,142.99 168.78,144.26 168.78,146.8 169.74,147.75
  Top 0.406: QQ7.6 169.1,153.47 168.47,152.83 167.83,153.47 QQ7.5
  Top 0.813: 168.47,152.83 168.47,152.21 PL3.6 169.51,147.75 169.74,147.75 171.64,147.75 173.55,145.85 173.55,137.59 174.82,136.32 D34.A
N$84
  Top 0.254: LED7.C 163.39,142.35 162.75,142.99 161.8,142.99 160.53,144.26 160.53,146.8 159.58,147.75
  Top 0.406: QQ8.7 160.21,153.47 160.85,152.83 161.48,153.47 QQ8.8
  Top 0.813: 160.85,152.83 160.85,152.21 PL3.7 159.81,147.75 159.58,147.75 157.67,147.75 155.77,145.85 155.77,137.59 154.5,136.32 D35.A
N$85  (via drill 0.5)
  Top 0.254: v160.85,142.67 LED8.C
  Top 0.406: QQ8.5 157.67,153.47 158.31,152.83 158.94,153.47 QQ8.6
  Top 0.813: 158.31,152.83 158.31,150.55 PL3.8 153.62,145.76 v153.62,142.67 D36.A
  Bottom 0.254: v153.62,142.67 v160.85,142.67
N$86
  Top 0.254: RN15.4 162.75,137.18 LED8.A
N$87
  Top 0.254: RN15.3 164.02,136.96 163.39,137.59 LED7.A
N$88
  Top 0.254: RN15.2 165.29,136.96 165.93,137.59 LED6.A
N$89
  Top 0.254: RN15.1 166.56,137.18 LED5.A
N$90  (1 unrouted)
N$91
  Top 0.254: R40.1 LED10.A
N$92
  Top 0.254: IC4.8 -94.21,38.74 -93.47,39.48 C8.1
N$93  (1 unrouted)
  Top 0.254: R44.1 R45.2
N$94
  Top 0.254: R39.1 LED9.A
N$95
  Top 0.254: IC4.1 -103,37.9 C11.1
N$96
  Top 0.254: C11.2 -105.53,37.58 -105.22,37.26 -104.9,37.26 -104.58,36.94 -104.58,32.18 -103.31,30.91 -101.41,30.91
  Top 0.61: IC4.3 -101.09,35.36 -101.41,35.04 -101.41,30.91 L1.1
N$97
  Top 0.254: C13.1 -85.21,37.58 -85.53,37.26 -89.98,37.26 -90.29,36.95 C12.1 -90.93,35.36 IC4.6
N$98
  Top 0.254: R36.2 C12.2
N$99
  Top 0.254: R37.1 R38.2 -88.07,33.45 -88.71,34.09 IC4.5
N$100
  Top 0.254: R41.1 LED11.A
N$101
  Top 0.254: R42.1 LED12.A
N$102
  Top 0.254: IC6.5 4.5,155.87 3.4,154.77 IC7.3
N$103  (2 unrouted)
N$104
  Top 0.254: RN16.5 78.41,139.93 79.57,141.08 79.57,146.48 78.3,147.75 S1.9 78.3,157.91 73.85,162.36 IC9.6
N$105
  Top 0.254: RN16.6 76.39,140.77 77.03,141.4 77.03,146.48 75.76,147.75 S1.10 75.76,159.18 73.85,161.09 IC9.5
N$106
  Top 0.254: RN16.7 75.12,140.77 74.49,141.4 74.49,146.48 73.22,147.75 S1.11 73.22,152.83 75.12,154.74 75.12,158.55 73.85,159.82 IC9.4
N$107
  Top 0.254: RN16.8 73.1,139.93 71.95,141.08 71.95,146.48 70.68,147.75 S1.12 70.68,152.83 71.95,154.1 73.22,154.1 74.49,155.37 74.49,157.91 73.85,158.55 IC9.3
N$108
  Top 0.254: RN17.5 68.25,139.93 69.41,141.08 69.41,146.48 68.14,147.75 S1.13 68.14,152.83 66.87,154.1 65.6,154.1 64.33,155.37 64.33,157.91 64.96,158.55 IC9.14
N$109
  Top 0.254: RN17.6 66.23,140.77 66.87,141.4 66.87,146.48 65.6,147.75 S1.14 65.6,152.83 63.69,154.74 63.69,158.55 64.96,159.82 IC9.13
N$110
  Top 0.254: RN17.7 64.96,140.77 64.33,141.4 64.33,146.48 63.06,147.75 S1.15 63.06,159.18 64.96,161.09 IC9.12
N$111
  Top 0.254: RN17.8 62.94,139.93 61.79,141.08 61.79,146.48 60.52,147.75 S1.16 60.52,157.91 64.96,162.36 IC9.11
N$112
  Top 0.254: RN18.5 101.27,139.93 102.43,141.08 102.43,146.48 101.16,147.75 S2.9 101.16,157.91 96.71,162.36 IC10.6
N$113
  Top 0.254: RN18.6 99.25,140.77 99.89,141.4 99.89,146.48 98.62,147.75 S2.10 98.62,159.18 96.71,161.09 IC10.5
N$114
  Top 0.254: RN18.7 97.98,140.77 97.35,141.4 97.35,146.48 96.08,147.75 S2.11 96.08,152.83 97.98,154.74 97.98,158.55 96.71,159.82 IC10.4
N$115
  Top 0.254: RN18.8 95.96,139.93 94.81,141.08 94.81,146.48 93.54,147.75 S2.12 93.54,152.83 94.81,154.1 96.08,154.1 97.35,155.37 97.35,157.91 96.71,158.55 IC10.3
N$116
  Top 0.254: RN19.5 91.11,139.93 92.27,141.08 92.27,146.48 91,147.75 S2.13 91,152.83 89.73,154.1 88.46,154.1 87.19,155.37 87.19,157.91 87.82,158.55 IC10.14
N$117
  Top 0.254: RN19.6 89.09,140.77 89.73,141.4 89.73,146.48 88.46,147.75 S2.14 88.46,152.83 86.55,154.74 86.55,158.55 87.82,159.82 IC10.13
N$118
  Top 0.254: RN19.7 87.82,140.77 87.19,141.4 87.19,146.48 85.92,147.75 S2.15 85.92,159.18 87.82,161.09 IC10.12
N$119
  Top 0.254: RN19.8 85.8,139.93 84.65,141.08 84.65,146.48 83.38,147.75 S2.16 83.38,157.91 87.82,162.36 IC10.11
N$120  (1 unrouted)
N$121
  Top 0.254: IC11.7 32.83,54.16 35.75,51.23 Q1.1 37.24,51.07 C26.1
N$122  (2 unrouted)
N$123
  Top 0.254: IC11.6 32.33,54.16 29.4,51.23 Q1.2 27.92,51.07 C27.1
N$126  (1 unrouted)
N$127  (1 unrouted)
PWR_EN
  Top 0.254: C9.1 R35.1 -91.25,38.53 -91.88,37.9 -91.88,37.26 -92.52,36.63 IC4.7
RESET  (3 unrouted)
SCL  (2 unrouted)
SDA  (2 unrouted)
SOLENOID0  (2 unrouted)
SOLENOID1  (2 unrouted)
SOLENOID2  (2 unrouted)
SOLENOID3  (2 unrouted)
SOLENOID4  (2 unrouted)
SOLENOID5  (2 unrouted)
SOLENOID6  (2 unrouted)
SOLENOID7  (2 unrouted)
SOLENOID_50V  (18 unrouted)
  Top 0.254: R43.2 3.8,160.02 4.5,159.32 IC6.8
  Top 0.813: PL3.4 158.36,142.62 159.26,141.72 159.26,140.13 | 159.26,140.13 159.26,137.66 D35.C | 159.26,140.13 D36.C | PL3.1 170.96,142.62 170.05,141.72 170.05,140.13 | 170.05,140.13 170.05,137.66 D34.C | 170.05,140.13 D33.C | PL4.1 198.9,142.62 197.99,141.72 197.99,140.13 | 197.99,140.13 197.99,137.66 D30.C | 197.99,140.13 D29.C | PL4.4 186.3,142.62 187.2,141.72 187.2,140.13 | 187.2,140.13 187.2,137.66 D31.C | D32.C 187.2,140.13
  Bottom 0.813: PL3.4 PL3.3 PL3.2 PL3.1 | PL4.4 PL4.3 PL4.2 PL4.1
SOLENOID_SENSE  (1 unrouted)
  Top 0.254: IC7.1 5.28,151.88 R44.2
SWCLK  (2 unrouted)
SWDIO  (2 unrouted)
SWITCH_12V  (4 unrouted)
  Top 0.254: IC2.4 -98.55,101.08 -97.8,101.83 R33.2
SWITCH_COL0  (1 unrouted)
  Top 0.254: RN3.1 RN1.4
SWITCH_COL0_PWR  (via drill 0.5)
  Top 0.254: X1.1 v97.98,110.92 T1.C | v97.98,91.87 RN2.1
  Bottom 0.254: X1.1 X2.1 X3.1 X4.1 | v97.98,110.92 v97.98,91.87
SWITCH_COL1  (1 unrouted)
  Top 0.254: RN3.2 RN1.3
SWITCH_COL1_PWR  (via drill 0.5)
  Top 0.254: X1.3 v96.71,105.84 T2.C | v96.71,93.14 RN2.2
  Bottom 0.254: X4.3 X3.3 X2.3 X1.3 | v96.71,105.84 v96.71,93.14
SWITCH_COL2  (1 unrouted)
  Top 0.254: RN3.3 RN1.2
SWITCH_COL2_PWR  (via drill 0.5)
  Top 0.254: X1.5 v95.44,100.76 T3.C | v95.44,91.87 RN2.3
  Bottom 0.254: X1.5 X2.5 X3.5 X4.5 | v95.44,100.76 v95.44,91.87
SWITCH_COL3  (1 unrouted)
  Top 0.254: RN3.4 RN1.1
SWITCH_COL3_PWR
  Top 0.254: X1.7 94.17,95.68 | 94.17,95.68 T4.C | 94.17,95.68 RN2.4
  Bottom 0.254: X4.7 X3.7 X2.7 X1.7
SWITCH_ROW0  (1 unrouted)
SWITCH_ROW0_PWR
  Top 0.254: RN4.1 86.55,84.89 85.92,85.52 85.92,86.79 | 85.92,86.79 D1.3 | 85.92,86.79 88.46,86.79 89.73,88.06 D2.3
SWITCH_ROW1  (1 unrouted)
SWITCH_ROW1_PWR
  Top 0.254: 82.11,86.79 D4.3 | 82.11,86.79 79.57,86.79 78.3,88.06 D3.3 | RN4.2 84.01,83.62 82.11,85.52 82.11,86.79
SWITCH_ROW2  (1 unrouted)
SWITCH_ROW2_PWR
  Top 0.254: 74.49,86.79 D6.3 | 74.49,86.79 71.95,86.79 70.68,88.06 D5.3 | RN4.3 77.66,82.35 74.49,85.52 74.49,86.79
SWITCH_ROW3  (1 unrouted)
SWITCH_ROW3_PWR
  Top 0.254: 66.87,86.79 D8.3 | 66.87,86.79 64.33,86.79 63.06,88.06 D7.3 | RN4.4 71.31,81.08 66.87,85.52 66.87,86.79
SWITCH_SENSE  (1 unrouted)
  Top 0.254: C6.1 IC2.3
SWO  (2 unrouted)
V+  (6 unrouted)
  Top 0.254: R43.1 0.4,160.02 -0.3,159.32 IC6.1